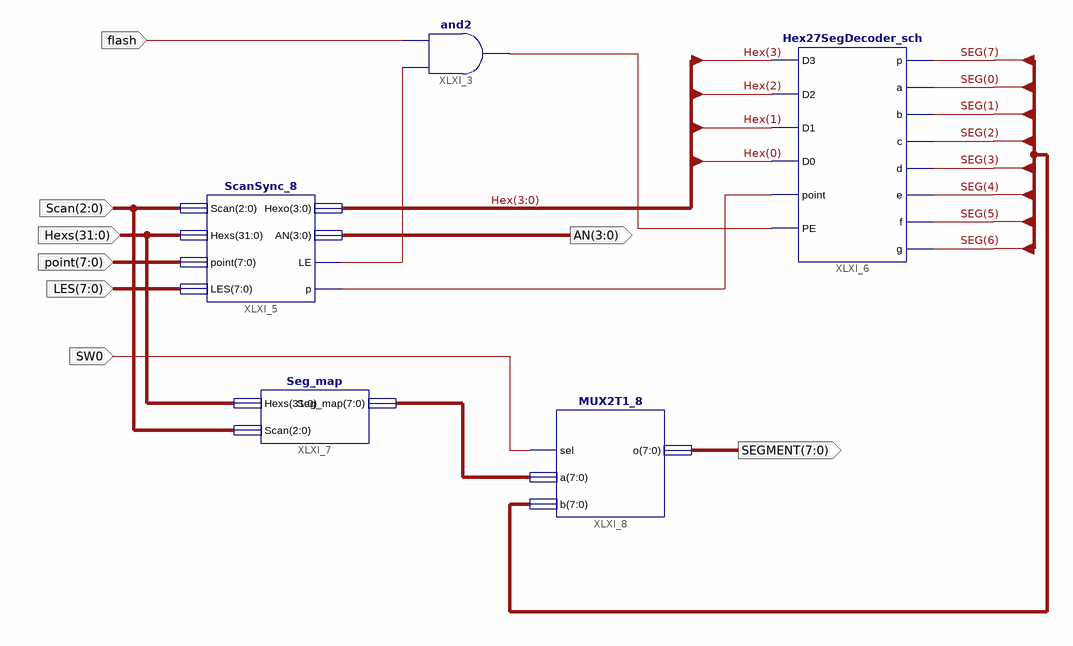
[diagram p0: schematic sheet 1]
// Xilinx ISE schematic Seg7_Dev.sch (kintex7) as structural Verilog: 5 symbols, 8 ports
module Seg7_Dev (
  input  flash,
  input  [2:0] Scan,
  input  [31:0] Hexs,
  input  [7:0] point,
  input  [7:0] LES,
  input  SW0,
  output [3:0] AN,
  output [7:0] SEGMENT
);

  wire XLXN_7, XLXN_8, XLXN_24;
  wire [3:0] Hex;
  wire [7:0] SEG, XLXN_28;

  and XLXI_3 (XLXN_8, XLXN_7, flash);
  ScanSync_8 XLXI_5 (.Scan(Scan), .Hexs(Hexs), .point(point), .LES(LES), .Hexo(Hex), .AN(AN), .LE(XLXN_7), .p(XLXN_24));
  Hex27SegDecoder_sch XLXI_6 (
    .D3(Hex[3]), .D2(Hex[2]), .D1(Hex[1]), .D0(Hex[0]), .point(XLXN_24), .PE(XLXN_8), .p(SEG[7]), .a(SEG[0]),
    .b(SEG[1]), .c(SEG[2]), .d(SEG[3]), .e(SEG[4]), .f(SEG[5]), .g(SEG[6]));
  Seg_map XLXI_7 (.Hexs(Hexs), .Scan(Scan), .Seg_map(XLXN_28));
  MUX2T1_8 XLXI_8 (.sel(SW0), .a(XLXN_28), .b(SEG), .o(SEGMENT));
endmodule
